# Altium schematic sheet 11_Power.SchDoc: Power (part 1 of 2)
size A3; Organization: Lime Microsystems; Address1: Surrey Tech Centre; Address2: Guildford GU2 7YG; Address3: Surrey; Address4: United Kingdom; SheetNumber: 11
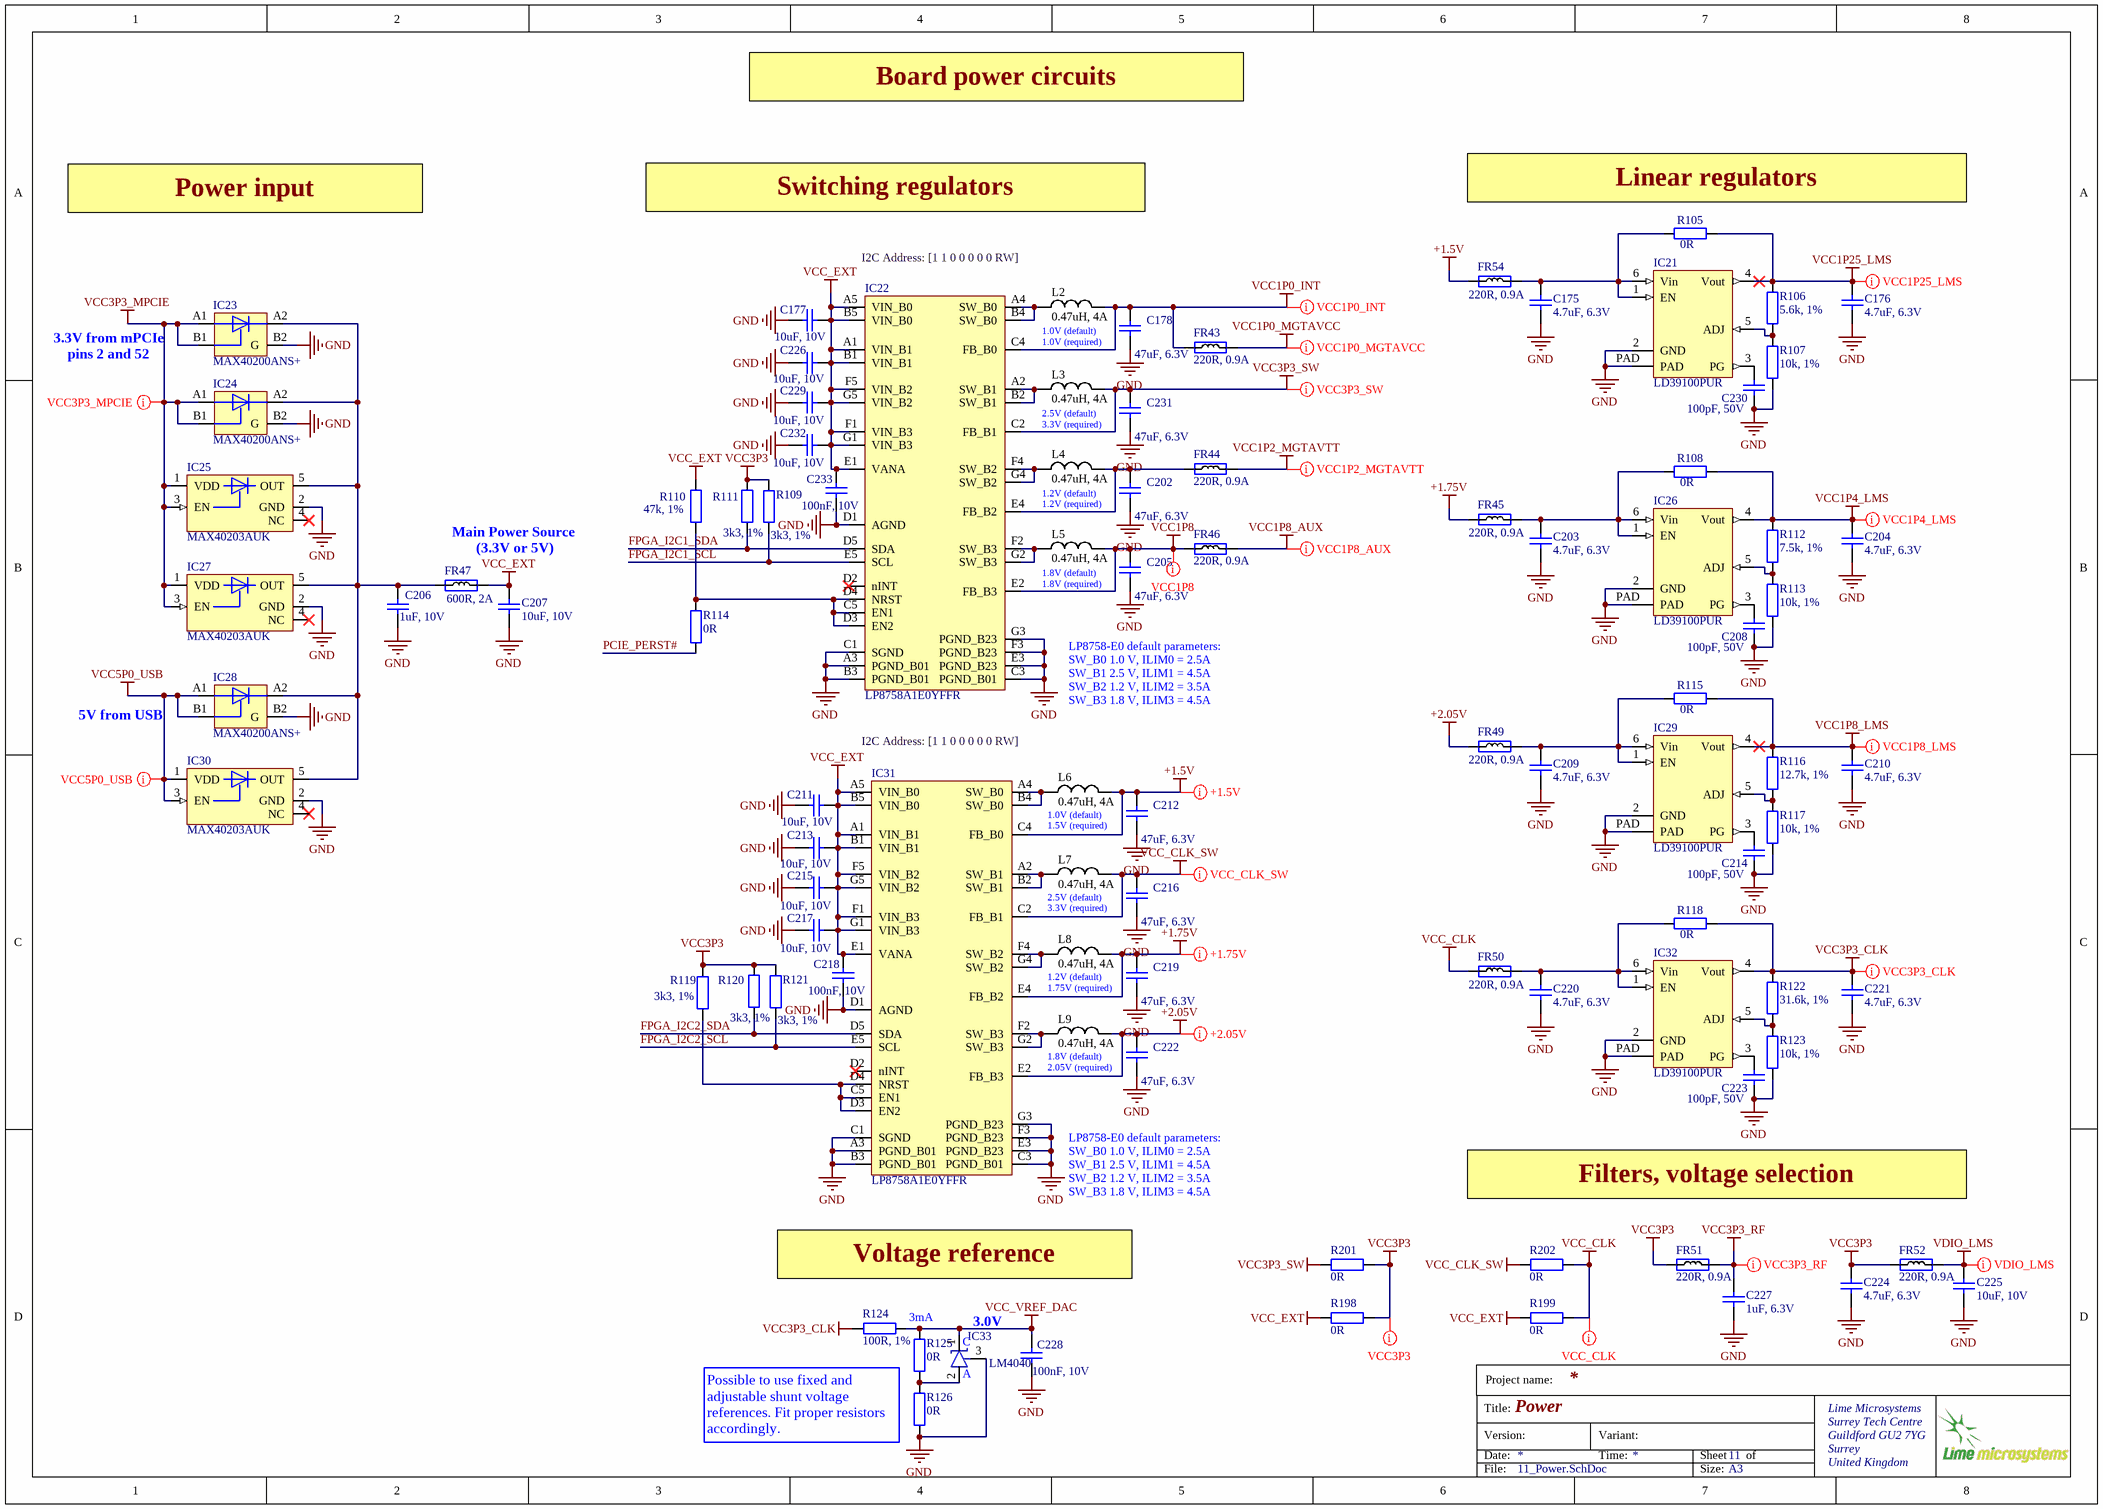
[diagram p0: 11_Power.SchDoc]

## Parts
C175  4.7uF, 6.3V  [CAP0402]
C176  4.7uF, 6.3V  [CAP0402]
C177  10uF, 10V  [CAP0603]
C178  47uF, 6.3V  [CAP0603]
C202  47uF, 6.3V  [CAP0603]
C203  4.7uF, 6.3V  [CAP0402]
C204  4.7uF, 6.3V  [CAP0402]
C205  47uF, 6.3V  [CAP0603]
C206  1uF, 10V  [CAP0402]
C207  10uF, 10V  [CAP0603]
C208  100pF, 50V  [CAP0201]
C209  4.7uF, 6.3V  [CAP0402]
C210  4.7uF, 6.3V  [CAP0402]
C211  10uF, 10V  [CAP0603]
C212  47uF, 6.3V  [CAP0603]
C213  10uF, 10V  [CAP0603]
C214  100pF, 50V  [CAP0201]
C215  10uF, 10V  [CAP0603]
C216  47uF, 6.3V  [CAP0603]
C217  10uF, 10V  [CAP0603]
C218  100nF, 10V  [CAP0201]
C219  47uF, 6.3V  [CAP0603]
C220  4.7uF, 6.3V  [CAP0402]
C221  4.7uF, 6.3V  [CAP0402]
C222  47uF, 6.3V  [CAP0603]
C223  100pF, 50V  [CAP0201]
C224  4.7uF, 6.3V  [CAP0402]
C225  10uF, 10V  [CAP0603]
C226  10uF, 10V  [CAP0603]
C227  1uF, 6.3V  [CAP0201]
C228  100nF, 10V  [CAP0201]
C229  10uF, 10V  [CAP0603]
C230  100pF, 50V  [CAP0201]
C231  47uF, 6.3V  [CAP0603]
C232  10uF, 10V  [CAP0603]
C233  100nF, 10V  [CAP0201]
FR43  220R, 0.9A  [RES0402]
FR44  220R, 0.9A  [RES0402]
FR45  220R, 0.9A  [RES0402]
FR46  220R, 0.9A  [RES0402]
FR47  600R, 2A  [RES0805]
FR49  220R, 0.9A  [RES0402]
FR50  220R, 0.9A  [RES0402]
FR51  220R, 0.9A  [RES0402]
FR52  220R, 0.9A  [RES0402]
FR54  220R, 0.9A  [RES0402]
IC21  LD39100PUR  [LD39100PUR]
IC22  LP8758A1E0YFFR  [LP8758A1E0YFFR_QUAD_DC-DC_35DSBGA]
IC23  MAX40200ANS+  [MAX40200ANS+_IDEAL_DIODE_4WLP]
IC24  MAX40200ANS+  [MAX40200ANS+_IDEAL_DIODE_4WLP]
IC25  MAX40203AUK  [SOT23-5_v1]
IC26  LD39100PUR  [LD39100PUR]
IC27  MAX40203AUK  [SOT23-5_v1]
IC28  MAX40200ANS+  [MAX40200ANS+_IDEAL_DIODE_4WLP]
IC29  LD39100PUR  [LD39100PUR]
IC30  MAX40203AUK  [SOT23-5_v1]
IC31  LP8758A1E0YFFR  [LP8758A1E0YFFR_QUAD_DC-DC_35DSBGA]
IC32  LD39100PUR  [LD39100PUR]
IC33  LM4040  [SOT23-3_v3]
L2  0.47uH, 4A  [IND0806]
L3  0.47uH, 4A  [IND0806]
L4  0.47uH, 4A  [IND0806]
L5  0.47uH, 4A  [IND0806]
L6  0.47uH, 4A  [IND0806]
L7  0.47uH, 4A  [IND0806]
L8  0.47uH, 4A  [IND0806]
L9  0.47uH, 4A  [IND0806]
R105  0R  [RES0201]
R106  5.6k, 1%  [RES0201]
R107  10k, 1%  [RES0201]
R108  0R  [RES0201]
R109  3k3, 1%  [RES0201]
R110  47k, 1%  [RES0201]
R111  3k3, 1%  [RES0201]
R112  7.5k, 1%  [RES0201]
R113  10k, 1%  [RES0201]
R114  0R  [RES0201]
R115  0R  [RES0201]
R116  12.7k, 1%  [RES0201]
R117  10k, 1%  [RES0201]
R118  0R  [RES0201]
R119  3k3, 1%  [RES0201]
R120  3k3, 1%  [RES0201]
R121  3k3, 1%  [RES0201]
R122  31.6k, 1%  [RES0201]
R123  10k, 1%  [RES0201]
R124  100R, 1%  [RES0201]
R125  0R  [RES0201]
R126  0R  [RES0201]
R198  0R  [RES0402]
R199  0R  [RES0402]
R201  0R  [RES0402]
R202  0R  [RES0402]

## Nets
+1.5V: C212.2 FR54.1 IC31.C4(FB_B0) L6.2
+1.75V: C219.2 FR45.1 IC31.E4(FB_B2) L8.2
+2.05V: C222.2 FR49.1 IC31.E2(FB_B3) L9.2
GND: C175.1 C176.1 C177.1 C178.1 C202.1 C203.1 C204.1 C205.1 C206.1 C207.1 C208.1 C209.1 C210.1 C211.1 C212.1 C213.1 C214.1 C215.1 C216.1 C217.1 C218.2 C219.1 C220.1 C221.1 C222.1 C223.1 C224.1 C225.1 C226.1 C227.2 C228.2 C229.1 C230.1 C231.1 C232.1 C233.2 IC21.2(GND) IC21.PAD IC22.A3(PGND_B01) IC22.B3(PGND_B01) IC22.C1(SGND) IC22.C3(PGND_B01) IC22.D1(AGND) IC22.E3(PGND_B23) IC22.F3(PGND_B23) IC22.G3(PGND_B23) IC23.B2(G) IC24.B2(G) IC25.2(GND) IC26.2(GND) IC26.PAD IC27.2(GND) IC28.B2(G) IC29.2(GND) IC29.PAD IC30.2(GND) IC31.A3(PGND_B01) IC31.B3(PGND_B01) IC31.C1(SGND) IC31.C3(PGND_B01) IC31.D1(AGND) IC31.E3(PGND_B23) IC31.F3(PGND_B23) IC31.G3(PGND_B23) IC32.2(GND) IC32.PAD IC33.3(NC/A) R107.2 R113.2 R117.2 R123.2 R126.2
VCC1P0_INT: C178.2 FR43.1 IC22.C4(FB_B0) L2.2
VCC1P0_MGTAVCC: FR43.2
VCC1P2_MGTAVTT: FR44.2
VCC1P4_LMS: C204.2 IC26.4(Vout) R108.2 R112.1
VCC1P8: C205.2 FR46.1 IC22.E2(FB_B3) L5.2
VCC1P8_AUX: FR46.2
VCC1P8_LMS: C210.2 IC29.4(Vout) R115.2 R116.1
VCC1P25_LMS: C176.2 IC21.4(Vout) R105.2 R106.1
VCC3P3: C224.2 FR51.1 FR52.1 R109.1 R111.1 R119.1 R120.1 R121.1 R198.2 R201.2
VCC3P3_CLK: C221.2 IC32.4(Vout) R118.2 R122.1 R124.2
VCC3P3_MPCIE: IC23.A1(VDD) IC23.B1(EN) IC24.A1(VDD) IC24.B1(EN) IC25.1(VDD) IC25.3(EN) IC27.1(VDD) IC27.3(EN)
VCC3P3_RF: C227.1 FR51.2
VCC3P3_SW: C231.2 IC22.C2(FB_B1) L3.2 R201.1
VCC5P0_USB: IC28.A1(VDD) IC28.B1(EN) IC30.1(VDD) IC30.3(EN)
VCC_CLK: FR50.1 R199.2 R202.2
VCC_CLK_SW: C216.2 IC31.C2(FB_B1) L7.2 R202.1
VCC_EXT: C177.2 C207.2 C211.2 C213.2 C215.2 C217.2 C218.1 C226.2 C229.2 C232.2 C233.1 FR47.2 IC22.A1(VIN_B1) IC22.A5(VIN_B0) IC22.B1(VIN_B1) IC22.B5(VIN_B0) IC22.E1(VANA) IC22.F1(VIN_B3) IC22.F5(VIN_B2) IC22.G1(VIN_B3) IC22.G5(VIN_B2) IC31.A1(VIN_B1) IC31.A5(VIN_B0) IC31.B1(VIN_B1) IC31.B5(VIN_B0) IC31.E1(VANA) IC31.F1(VIN_B3) IC31.F5(VIN_B2) IC31.G1(VIN_B3) IC31.G5(VIN_B2) R110.1 R198.1 R199.1
VCC_VREF_DAC: C228.1 IC33.1(K) R124.1 R125.1
VDIO_LMS: C225.2 FR52.2
FPGA_I2C1_SCL: IC22.E5(SCL) R109.2
FPGA_I2C1_SDA: IC22.D5(SDA) R111.2
FPGA_I2C2_SCL: IC31.E5(SCL) R121.2
FPGA_I2C2_SDA: IC31.D5(SDA) R120.2
PCIE_PERST#: R114.1
NetC175_2: C175.2 FR54.2 IC21.1(EN) IC21.6(Vin) R105.1
NetC202_2: C202.2 FR44.1 IC22.E4(FB_B2) L4.2
NetC203_2: C203.2 FR45.2 IC26.1(EN) IC26.6(Vin) R108.1
NetC206_2: C206.2 FR47.1 IC23.A2(OUT) IC24.A2(OUT) IC25.5(OUT) IC27.5(OUT) IC28.A2(OUT) IC30.5(OUT)
NetC208_2: C208.2 IC26.3(PG)
NetC209_2: C209.2 FR49.2 IC29.1(EN) IC29.6(Vin) R115.1
NetC214_2: C214.2 IC29.3(PG)
NetC220_2: C220.2 FR50.2 IC32.1(EN) IC32.6(Vin) R118.1
NetC223_2: C223.2 IC32.3(PG)
NetC230_2: C230.2 IC21.3(PG)
NetIC21_5: IC21.5(ADJ) R106.2 R107.1
NetIC22_A2: IC22.A2(SW_B1) IC22.B2(SW_B1) L3.1
NetIC22_A4: IC22.A4(SW_B0) IC22.B4(SW_B0) L2.1
NetIC22_C5: IC22.C5(EN1) IC22.D3(EN2) IC22.D4(NRST) R110.2 R114.2
NetIC22_F2: IC22.F2(SW_B3) IC22.G2(SW_B3) L5.1
NetIC22_F4: IC22.F4(SW_B2) IC22.G4(SW_B2) L4.1
NetIC26_5: IC26.5(ADJ) R112.2 R113.1
NetIC29_5: IC29.5(ADJ) R116.2 R117.1
NetIC31_A2: IC31.A2(SW_B1) IC31.B2(SW_B1) L7.1
NetIC31_A4: IC31.A4(SW_B0) IC31.B4(SW_B0) L6.1
NetIC31_C5: IC31.C5(EN1) IC31.D3(EN2) IC31.D4(NRST) R119.2
NetIC31_F2: IC31.F2(SW_B3) IC31.G2(SW_B3) L9.1
NetIC31_F4: IC31.F4(SW_B2) IC31.G4(SW_B2) L8.1
NetIC32_5: IC32.5(ADJ) R122.2 R123.1
NetIC33_2: IC33.2(A) R125.2 R126.1

Not connected (* = marked no-connect by the designer): IC22 D2(nINT)*; IC25 4(NC)*; IC27 4(NC)*; IC30 4(NC)*; IC31 D2(nINT)*

## Layout directives
net class VDIO_LMS: VDIO_LMS
net class VCC1P25_LMS: VCC1P25_LMS
net class VCC1P4_LMS: VCC1P4_LMS
net class VCC1P8_LMS: VCC1P8_LMS
net class VCC3P3_CLK: VCC3P3_CLK
net class +1.5V: +1.5V
net class VCC_CLK_SW: VCC_CLK_SW
net class +1.75V: +1.75V
net class +2.05V: +2.05V
net class VCC1P8_AUX: VCC1P8_AUX
net class VCC1P2_MGTAVTT: VCC1P2_MGTAVTT
net class VCC3P3_SW: VCC3P3_SW
net class VCC1P0_MGTAVCC: VCC1P0_MGTAVCC
net class VCC1P0_INT: VCC1P0_INT
net class VCC3P3_MPCIE: VCC3P3_MPCIE
net class VCC5P0_USB: VCC5P0_USB
net class VCC3P3_RF: VCC3P3_RF
net class VCC_CLK: VCC_CLK
net class VCC3P3: VCC3P3
net class VCC1P8: VCC1P8

## Notes on the sheet
- Board power circuits
- Power input
- Switching regulators
- (near R105) Linear regulators
- I2C Address: [1 1 0 0 0 0 0 RW]
- 3.3V from mPCIe pins 2 and 52
- 1.0V (default)
  1.0V (required)
- 2.5V (default)
  3.3V (required)
- 1.2V (default)
  1.2V (required)
- (near FR47) Main Power Source
  (3.3V or 5V)
- 1.8V (default)
  1.8V (required)
- LP8758-E0 default parameters:
  SW_B0 1.0 V, ILIM0 = 2.5A
  SW_B1 2.5 V, ILIM1 = 4.5A
  SW_B2 1.2 V, ILIM2 = 3.5A
  SW_B3 1.8 V, ILIM3 = 4.5A
- 5V from USB
- 1.0V (default)
  1.5V (required)
- 1.2V (default)
  1.75V (required)
- 1.8V (default)
  2.05V (required)
- Filters, voltage selection
- Voltage reference
- 3mA
- 3.0V
- (near IC33) A
- (near IC33) C
- Possible to use fixed and adjustable shunt voltage references. Fit proper resistors accordingly.
- Project name:
- Title:
- Version:
- Date:
- Variant:
- Time:
- Sheet
- of
- File:
- Size:
- A3